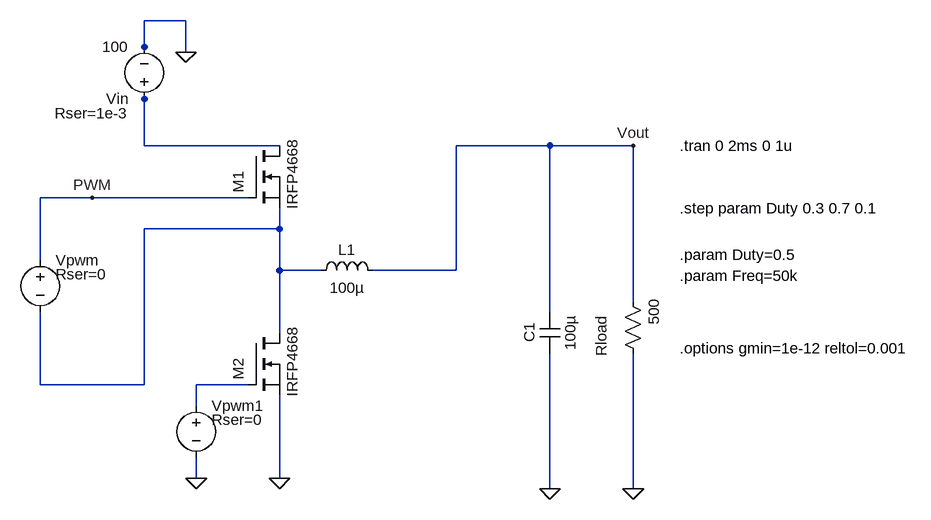
[diagram p0: schematic Generic_Buck_Converter_v2 copy.asc]
Generic_Buck_Converter_v2 copy.asc, the LTspice schematic file:
Version 4
SHEET 1 1556 1020
WIRE 224 -112 160 -112
WIRE 160 -72 160 -112
WIRE 160 -64 160 -72
WIRE 224 -64 224 -112
WIRE 160 8 160 0
WIRE 160 80 160 8
WIRE 368 80 160 80
WIRE 784 80 640 80
WIRE 912 80 784 80
WIRE 80 160 0 160
WIRE 320 160 80 160
WIRE 368 208 368 176
WIRE 368 208 160 208
WIRE 0 256 0 160
WIRE 368 272 368 208
WIRE 432 272 368 272
WIRE 640 272 640 80
WIRE 640 272 512 272
WIRE 912 320 912 80
WIRE 784 336 784 80
WIRE 368 368 368 272
WIRE 0 448 0 336
WIRE 160 448 160 208
WIRE 160 448 0 448
WIRE 320 448 240 448
WIRE 240 480 240 448
WIRE 240 592 240 560
WIRE 368 592 368 464
WIRE 784 608 784 400
WIRE 912 608 912 400
FLAG 80 160 PWM
FLAG 224 -64 0
FLAG 784 608 0
FLAG 912 608 0
FLAG 912 80 Vout
FLAG 240 592 0
FLAG 368 592 0
SYMBOL voltage 160 24 R180
WINDOW 123 24 124 Left 2
WINDOW 39 24 -6 Left 2
SYMATTR SpiceLine Rser=1e-3
SYMATTR InstName Vin
SYMATTR Value 100
SYMBOL nmos 320 80 R0
WINDOW 0 0 56 VBottom 2
WINDOW 3 52 44 VTop 2
SYMATTR InstName M1
SYMATTR Value IRFP4668
SYMBOL ind 416 288 R270
WINDOW 0 32 56 VTop 2
WINDOW 3 5 56 VBottom 2
SYMATTR InstName L1
SYMATTR Value 100µ
SYMBOL cap 768 336 R0
WINDOW 0 0 32 VBottom 2
WINDOW 3 32 32 VTop 2
SYMATTR InstName C1
SYMATTR Value 100µ
SYMBOL res 896 304 R0
WINDOW 0 -17 69 VBottom 2
WINDOW 3 32 32 VTop 2
SYMATTR InstName Rload
SYMATTR Value 500
SYMBOL voltage 0 240 R0
WINDOW 123 0 0 Left 2
WINDOW 39 24 38 Left 2
WINDOW 3 286 105 Invisible 2
SYMATTR SpiceLine Rser=0
SYMATTR Value PULSE(0 15 0 100n 100n {Duty/Freq} {1/Freq})
SYMATTR InstName Vpwm
SYMBOL nmos 320 368 R0
WINDOW 0 0 56 VBottom 2
WINDOW 3 52 44 VTop 2
SYMATTR InstName M2
SYMATTR Value IRFP4668
SYMBOL voltage 240 464 R0
WINDOW 123 0 0 Left 2
WINDOW 39 24 38 Left 2
WINDOW 3 286 105 Invisible 2
SYMATTR SpiceLine Rser=0
SYMATTR Value PULSE(15 0 {Duty/Freq + 200n} 100n 100n {(1-Duty)/Freq - 100n} {1/Freq})
SYMATTR InstName Vpwm1
TEXT 984 80 Left 2 !.tran 0 2ms 0 1u
TEXT 984 176 Left 2 !.step param Duty 0.3 0.7 0.1
TEXT 984 248 Left 2 !.param Duty=0.5
TEXT 984 280 Left 2 !.param Freq=50k
TEXT 984 392 Left 2 !.options gmin=1e-12 reltol=0.001

The netlist it stands for:
* Generic_Buck_Converter_v2 copy.asc
Vin N001 0 100 Rser=1e-3
M1 N001 PWM N002 N002 IRFP4668
L1 N002 Vout 100µ
C1 Vout 0 100µ
Rload Vout 0 500
Vpwm PWM N002 PULSE(0 15 0 100n 100n {Duty/Freq} {1/Freq}) Rser=0
M2 N002 N003 0 0 IRFP4668
Vpwm1 N003 0 PULSE(15 0 {Duty/Freq + 200n} 100n 100n {(1-Duty)/Freq - 100n} {1/Freq}) Rser=0
.model NMOS NMOS
.model PMOS PMOS
.lib standard.mos
.tran 0 2ms 0 1u
.step param Duty 0.3 0.7 0.1
.param Duty=0.5
.param Freq=50k
.options gmin=1e-12 reltol=0.001
.backanno
.end